# Altium project x-IMU3-SA-A8.PrjPcb
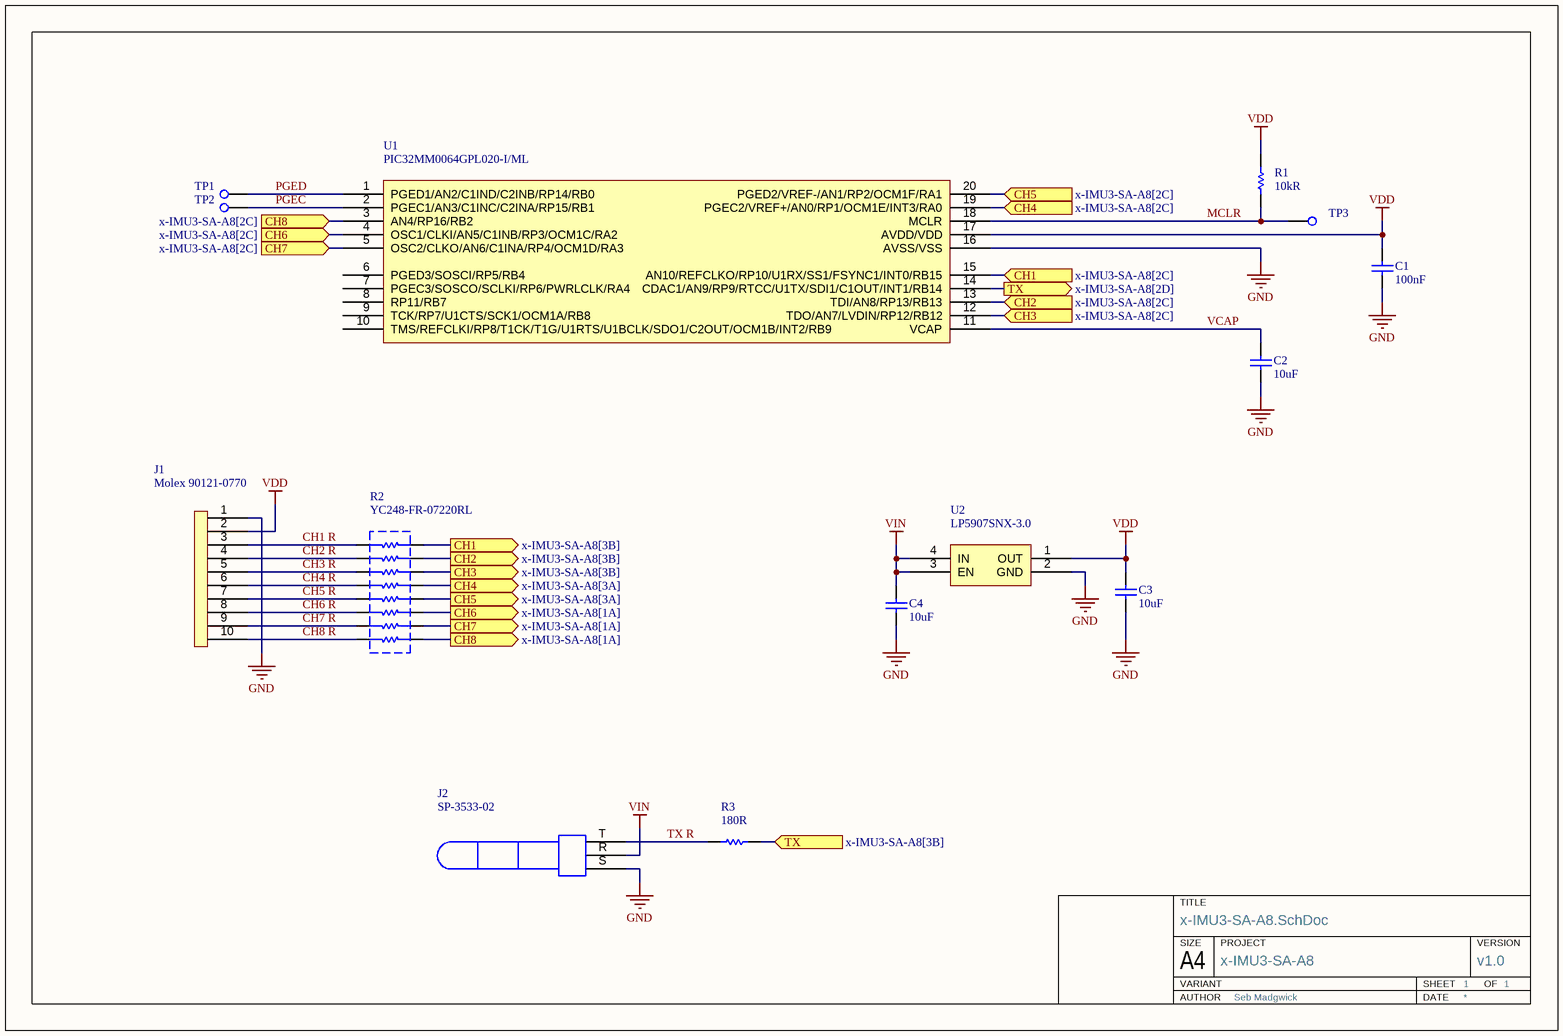
[diagram p0: x-IMU3-SA-A8.SchDoc]
Author: Seb Madgwick; Project: x-IMU3-SA-A8; Version: v1.0
1 sheet, 14 parts. Net scope: flat (ports and power ports of the same name join across sheets).
Board file: x-IMU3-SA-A8.PcbDoc

## Sheet x-IMU3-SA-A8.SchDoc
size A4; SheetNumber: 1; SheetTotal: 1

### Parts
C1  100nF  [Capacitor 0402]
C2  10uF  [Capacitor 0402]
C3  10uF  [Capacitor 0402]
C4  10uF  [Capacitor 0402]
J1  Molex 90121-0770  [Molex 90121-0770]
J2  SP-3533-02  [SP-3533-02]
R1  10kR  [Resistor 0402]
R2  YC248-FR-07220RL  [YC248]
R3  180R  [Resistor 0402]
TP1  Test Point  [Test Point 1mm]  (value not drawn)
TP2  Test Point  [Test Point 1mm]  (value not drawn)
TP3  Test Point  [Test Point 1mm]  (value not drawn)
U1  PIC32MM0064GPL020-I/ML  [QFN-20]
U2  LP5907SNX-3.0  [X2SON]

### Ports
CH1 (in, see x-IMU3-SA-A8[2C]), CH1 (out, see x-IMU3-SA-A8[3B]), CH2 (in, see x-IMU3-SA-A8[2C]), CH2 (out, see x-IMU3-SA-A8[3B]), CH3 (in, see x-IMU3-SA-A8[2C]), CH3 (out, see x-IMU3-SA-A8[3B]), CH4 (in, see x-IMU3-SA-A8[2C]), CH4 (out, see x-IMU3-SA-A8[3A]), CH5 (in, see x-IMU3-SA-A8[2C]), CH5 (out, see x-IMU3-SA-A8[3A]), CH6 (in, see x-IMU3-SA-A8[2C]), CH6 (out, see x-IMU3-SA-A8[1A]), CH7 (in, see x-IMU3-SA-A8[2C]), CH7 (out, see x-IMU3-SA-A8[1A]), CH8 (in, see x-IMU3-SA-A8[2C]), CH8 (out, see x-IMU3-SA-A8[1A]), TX (in, see x-IMU3-SA-A8[3B]), TX (out, see x-IMU3-SA-A8[2D])

### Nets
GND: C1.1 C2.1 C3.1 C4.1 J1.1 J2.S U1.16(AVSS/VSS) U2.2(GND)
VDD: C1.2 C3.2 J1.2 R1.2 U1.17(AVDD/VDD) U2.1(OUT)
VIN: C4.2 J2.R U2.3(EN) U2.4(IN)
CH1: R2.1 U1.15(AN10/REFCLKO/RP10/U1RX/SS1/FSYNC1/INT0/RB15) ; port CH1
CH1 R: J1.3 R2.16
CH2: R2.2 U1.13(TDI/AN8/RP13/RB13) ; port CH2
CH2 R: J1.4 R2.15
CH3: R2.3 U1.12(TDO/AN7/LVDIN/RP12/RB12) ; port CH3
CH3 R: J1.5 R2.14
CH4: R2.4 U1.19(PGEC2/VREF+/AN0/RP1/OCM1E/INT3/RA0) ; port CH4
CH4 R: J1.6 R2.13
CH5: R2.5 U1.20(PGED2/VREF-/AN1/RP2/OCM1F/RA1) ; port CH5
CH5 R: J1.7 R2.12
CH6: R2.6 U1.4(OSC1/CLKI/AN5/C1INB/RP3/OCM1C/RA2) ; port CH6
CH6 R: J1.8 R2.11
CH7: R2.7 U1.5(OSC2/CLKO/AN6/C1INA/RP4/OCM1D/RA3) ; port CH7
CH7 R: J1.9 R2.10
CH8: R2.8 U1.3(AN4/RP16/RB2) ; port CH8
CH8 R: J1.10 R2.9
MCLR: R1.1 TP3.1 U1.18(MCLR)
PGEC: TP2.1 U1.2(PGEC1/AN3/C1INC/C2INA/RP15/RB1)
PGED: TP1.1 U1.1(PGED1/AN2/C1IND/C2INB/RP14/RB0)
TX: R3.2 U1.14(CDAC1/AN9/RP9/RTCC/U1TX/SDI1/C1OUT/INT1/RB14) ; port TX
TX R: J2.T R3.1
VCAP: C2.2 U1.11(VCAP)

Not connected (* = marked no-connect by the designer): U1 6(PGED3/SOSCI/RP5/RB4) 7(PGEC3/SOSCO/SCLKI/RP6/PWRLCLK/RA4) 8(RP11/RB7) 9(TCK/RP7/U1CTS/SCK1/OCM1A/RB8) 10(TMS/REFCLKI/RP8/T1CK/T1G/U1RTS/U1BCLK/SDO1/C2OUT/OCM1B/INT2/RB9)

### Notes on the sheet
- TITLE
- SIZE
- A4
- VARIANT
- PROJECT
- SHEET
- VERSION
- OF
- AUTHOR
- DATE

### Library data of the parts
C1-C4 = Capacitor
R1 R3 = Resistor
R2 = Resistor Array 8
U2 = LP5907SNX-X.X